# EAGLE design current_mirror (EAGLE 9.5.0)

## Sheet 1 of 2
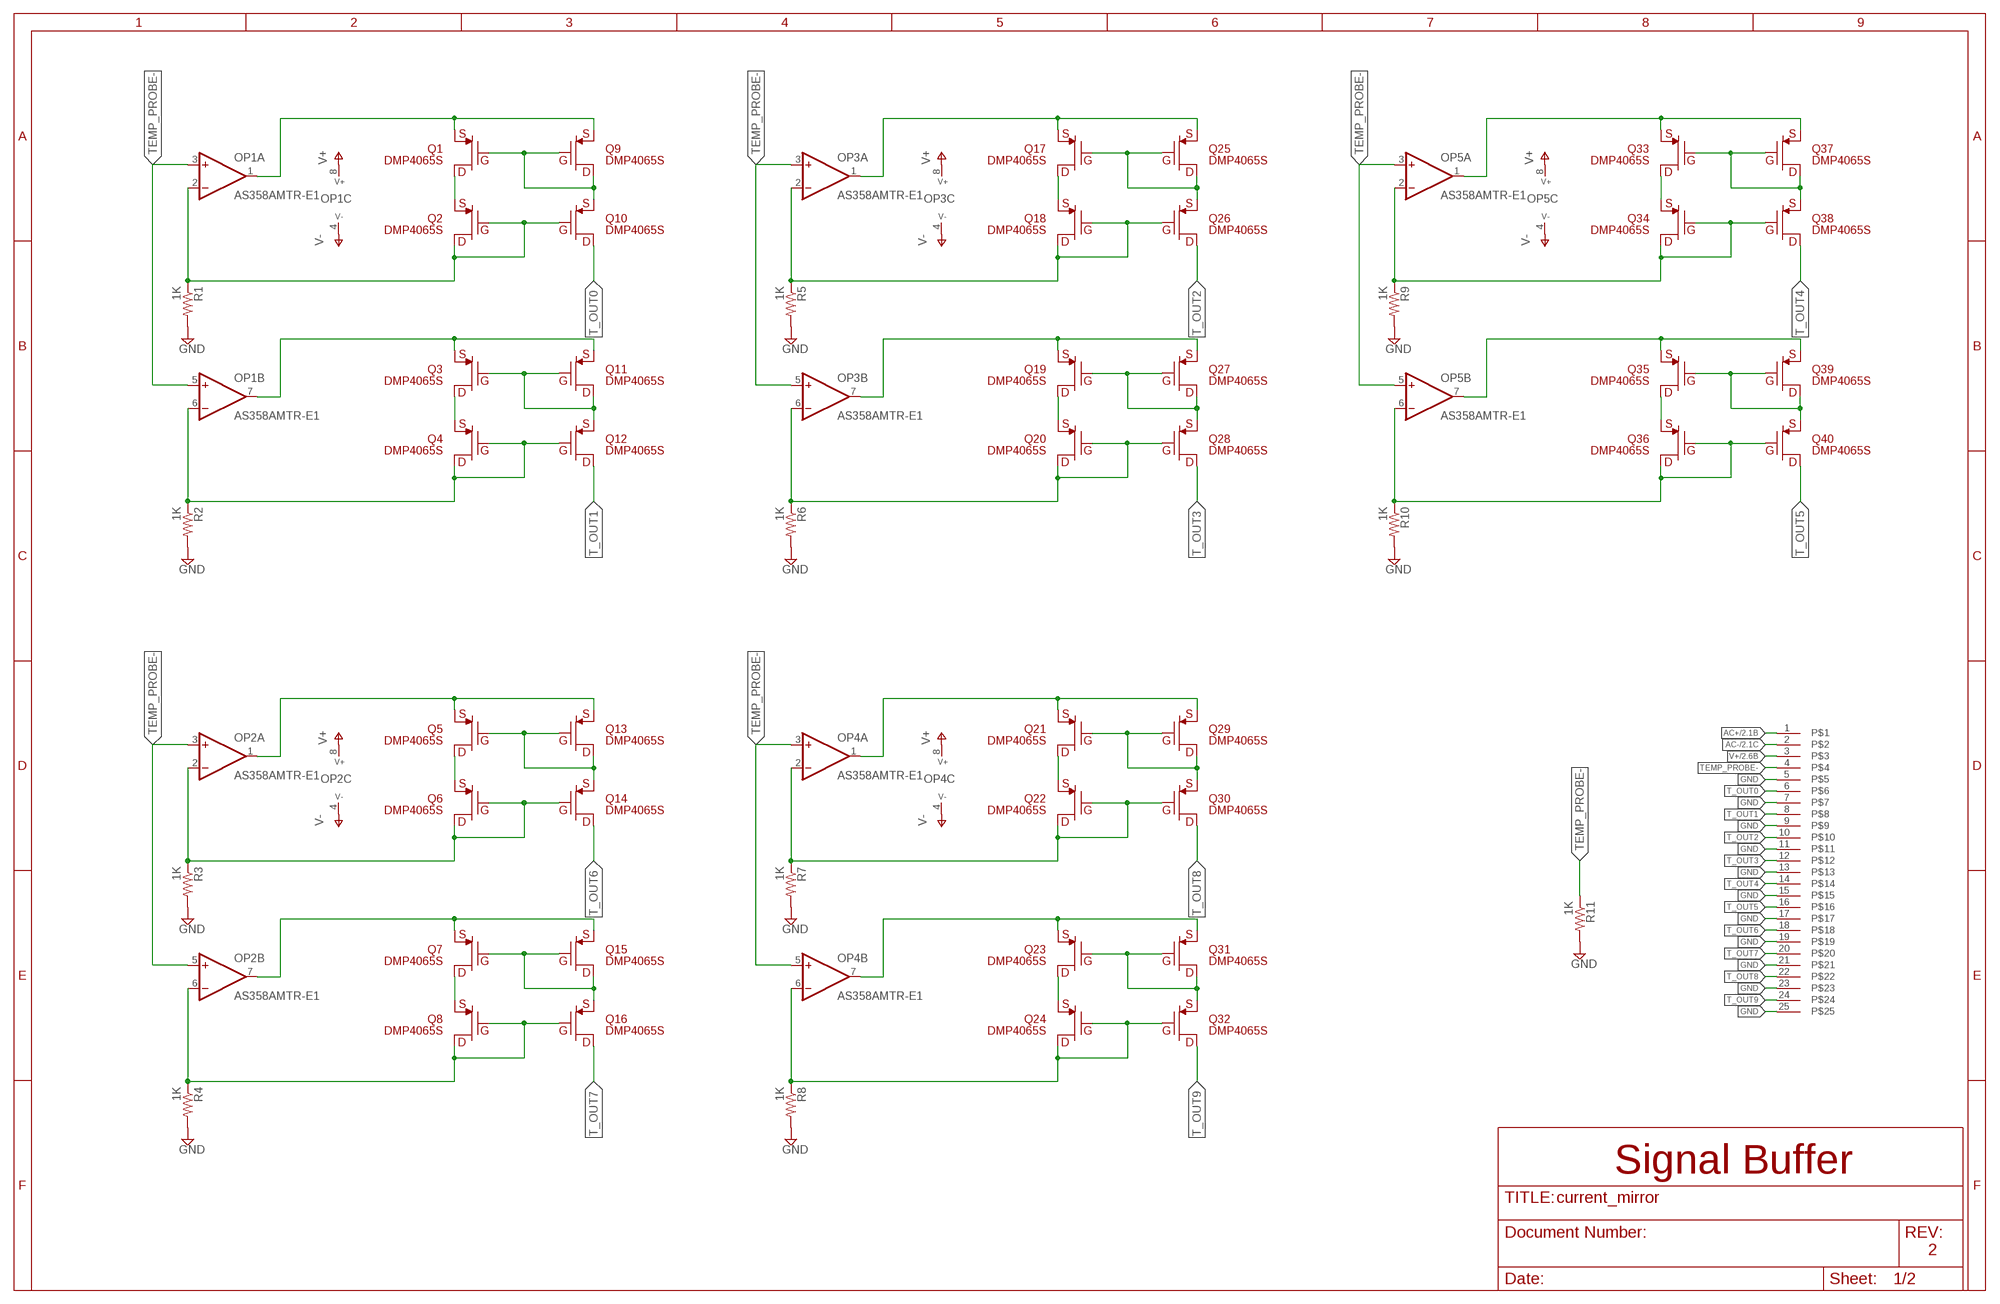
[diagram p0: schematic, sheet 1]

### Parts
J1  2-282836-6  [SCREW_TERMINAL_25]
OP1  AS358AMTR-E1  [SOIC-8]
OP2  AS358AMTR-E1  [SOIC-8]
OP3  AS358AMTR-E1  [SOIC-8]
OP4  AS358AMTR-E1  [SOIC-8]
OP5  AS358AMTR-E1  [SOIC-8]
Q1  DMP4065S  [SOT23]
Q2  DMP4065S  [SOT23]
Q3  DMP4065S  [SOT23]
Q4  DMP4065S  [SOT23]
Q5  DMP4065S  [SOT23]
Q6  DMP4065S  [SOT23]
Q7  DMP4065S  [SOT23]
Q8  DMP4065S  [SOT23]
Q9  DMP4065S  [SOT23]
Q10  DMP4065S  [SOT23]
Q11  DMP4065S  [SOT23]
Q12  DMP4065S  [SOT23]
Q13  DMP4065S  [SOT23]
Q14  DMP4065S  [SOT23]
Q15  DMP4065S  [SOT23]
Q16  DMP4065S  [SOT23]
Q17  DMP4065S  [SOT23]
Q18  DMP4065S  [SOT23]
Q19  DMP4065S  [SOT23]
Q20  DMP4065S  [SOT23]
Q21  DMP4065S  [SOT23]
Q22  DMP4065S  [SOT23]
Q23  DMP4065S  [SOT23]
Q24  DMP4065S  [SOT23]
Q25  DMP4065S  [SOT23]
Q26  DMP4065S  [SOT23]
Q27  DMP4065S  [SOT23]
Q28  DMP4065S  [SOT23]
Q29  DMP4065S  [SOT23]
Q30  DMP4065S  [SOT23]
Q31  DMP4065S  [SOT23]
Q32  DMP4065S  [SOT23]
Q33  DMP4065S  [SOT23]
Q34  DMP4065S  [SOT23]
Q35  DMP4065S  [SOT23]
Q36  DMP4065S  [SOT23]
Q37  DMP4065S  [SOT23]
Q38  DMP4065S  [SOT23]
Q39  DMP4065S  [SOT23]
Q40  DMP4065S  [SOT23]
R1  1K  R-US_R1206  [R1206]
R2  1K  R-US_R1206  [R1206]
R3  1K  R-US_R1206  [R1206]
R4  1K  R-US_R1206  [R1206]
R5  1K  R-US_R1206  [R1206]
R6  1K  R-US_R1206  [R1206]
R7  1K  R-US_R1206  [R1206]
R8  1K  R-US_R1206  [R1206]
R9  1K  R-US_R1206  [R1206]
R10  1K  R-US_R1206  [R1206]
R11  1K  R-US_R1206  [R1206]

### Nets
AC+ [POWER]: J1.1 ; also sheet 2
AC- [POWER]: J1.2 ; also sheet 2
GND [GND]: J1.5 J1.7 J1.9 J1.11 J1.13 J1.15 J1.17 J1.19 J1.21 J1.23 J1.25 R1.2 R2.2 R3.2 R4.2 R5.2 R6.2 R7.2 R8.2 R9.2 R10.2 R11.2 ; also sheet 2
N$1: OP1.1(A:OUT) Q1.2(S1) Q9.2(S1)
N$2: Q1.1(G1) Q9.1(G1) Q9.3(D1) Q10.2(S1)
N$3: Q1.3(D1) Q2.2(S1)
N$4: OP1.7(B:OUT) Q3.2(S1) Q11.2(S1)
N$6: OP1.2(A:-IN) Q2.1(G1) Q2.3(D1) Q10.1(G1) R1.1
N$7: Q3.1(G1) Q11.1(G1) Q11.3(D1) Q12.2(S1)
N$8: Q3.3(D1) Q4.2(S1)
N$10: OP1.6(B:-IN) Q4.1(G1) Q4.3(D1) Q12.1(G1) R2.1
N$13: OP3.1(A:OUT) Q17.2(S1) Q25.2(S1)
N$14: Q17.1(G1) Q25.1(G1) Q25.3(D1) Q26.2(S1)
N$15: Q17.3(D1) Q18.2(S1)
N$16: OP3.2(A:-IN) Q18.1(G1) Q18.3(D1) Q26.1(G1) R5.1
N$17: OP3.7(B:OUT) Q19.2(S1) Q27.2(S1)
N$18: Q19.1(G1) Q27.1(G1) Q27.3(D1) Q28.2(S1)
N$19: Q19.3(D1) Q20.2(S1)
N$20: OP3.6(B:-IN) Q20.1(G1) Q20.3(D1) Q28.1(G1) R6.1
N$21: OP5.1(A:OUT) Q33.2(S1) Q37.2(S1)
N$22: Q33.1(G1) Q37.1(G1) Q37.3(D1) Q38.2(S1)
N$23: Q33.3(D1) Q34.2(S1)
N$24: OP5.2(A:-IN) Q34.1(G1) Q34.3(D1) Q38.1(G1) R9.1
N$25: OP5.7(B:OUT) Q35.2(S1) Q39.2(S1)
N$26: Q35.1(G1) Q39.1(G1) Q39.3(D1) Q40.2(S1)
N$27: Q35.3(D1) Q36.2(S1)
N$28: OP5.6(B:-IN) Q36.1(G1) Q36.3(D1) Q40.1(G1) R10.1
N$29: OP2.1(A:OUT) Q5.2(S1) Q13.2(S1)
N$30: Q5.1(G1) Q13.1(G1) Q13.3(D1) Q14.2(S1)
N$31: Q5.3(D1) Q6.2(S1)
N$32: OP2.2(A:-IN) Q6.1(G1) Q6.3(D1) Q14.1(G1) R3.1
N$33: OP2.7(B:OUT) Q7.2(S1) Q15.2(S1)
N$34: Q7.1(G1) Q15.1(G1) Q15.3(D1) Q16.2(S1)
N$35: Q7.3(D1) Q8.2(S1)
N$36: OP2.6(B:-IN) Q8.1(G1) Q8.3(D1) Q16.1(G1) R4.1
N$37: OP4.1(A:OUT) Q21.2(S1) Q29.2(S1)
N$38: Q21.1(G1) Q29.1(G1) Q29.3(D1) Q30.2(S1)
N$39: Q21.3(D1) Q22.2(S1)
N$40: OP4.2(A:-IN) Q22.1(G1) Q22.3(D1) Q30.1(G1) R7.1
N$41: OP4.7(B:OUT) Q23.2(S1) Q31.2(S1)
N$42: Q23.1(G1) Q31.1(G1) Q31.3(D1) Q32.2(S1)
N$43: Q23.3(D1) Q24.2(S1)
N$44: OP4.6(B:-IN) Q24.1(G1) Q24.3(D1) Q32.1(G1) R8.1
T_OUT0: J1.6 Q10.3(D1)
T_OUT1: J1.8 Q12.3(D1)
T_OUT2: J1.10 Q26.3(D1)
T_OUT3: J1.12 Q28.3(D1)
T_OUT4: J1.14 Q38.3(D1)
T_OUT5: J1.16 Q40.3(D1)
T_OUT6: J1.18 Q14.3(D1)
T_OUT7: J1.20 Q16.3(D1)
T_OUT8: J1.22 Q30.3(D1)
T_OUT9: J1.24 Q32.3(D1)
TEMP_PROBE-: J1.4 OP1.3(A:+IN) OP1.5(B:+IN) OP2.3(A:+IN) OP2.5(B:+IN) OP3.3(A:+IN) OP3.5(B:+IN) OP4.3(A:+IN) OP4.5(B:+IN) OP5.3(A:+IN) OP5.5(B:+IN) R11.1
V+ [POWER]: J1.3 OP1.8(C:V+) OP2.8(C:V+) OP3.8(C:V+) OP4.8(C:V+) OP5.8(C:V+) ; also sheet 2
V- [POWER]: OP1.4(C:V-) OP2.4(C:V-) OP3.4(C:V-) OP4.4(C:V-) OP5.4(C:V-) ; also sheet 2

### Notes on the sheet
- Signal Buffer
- 2

## Sheet 2 of 2
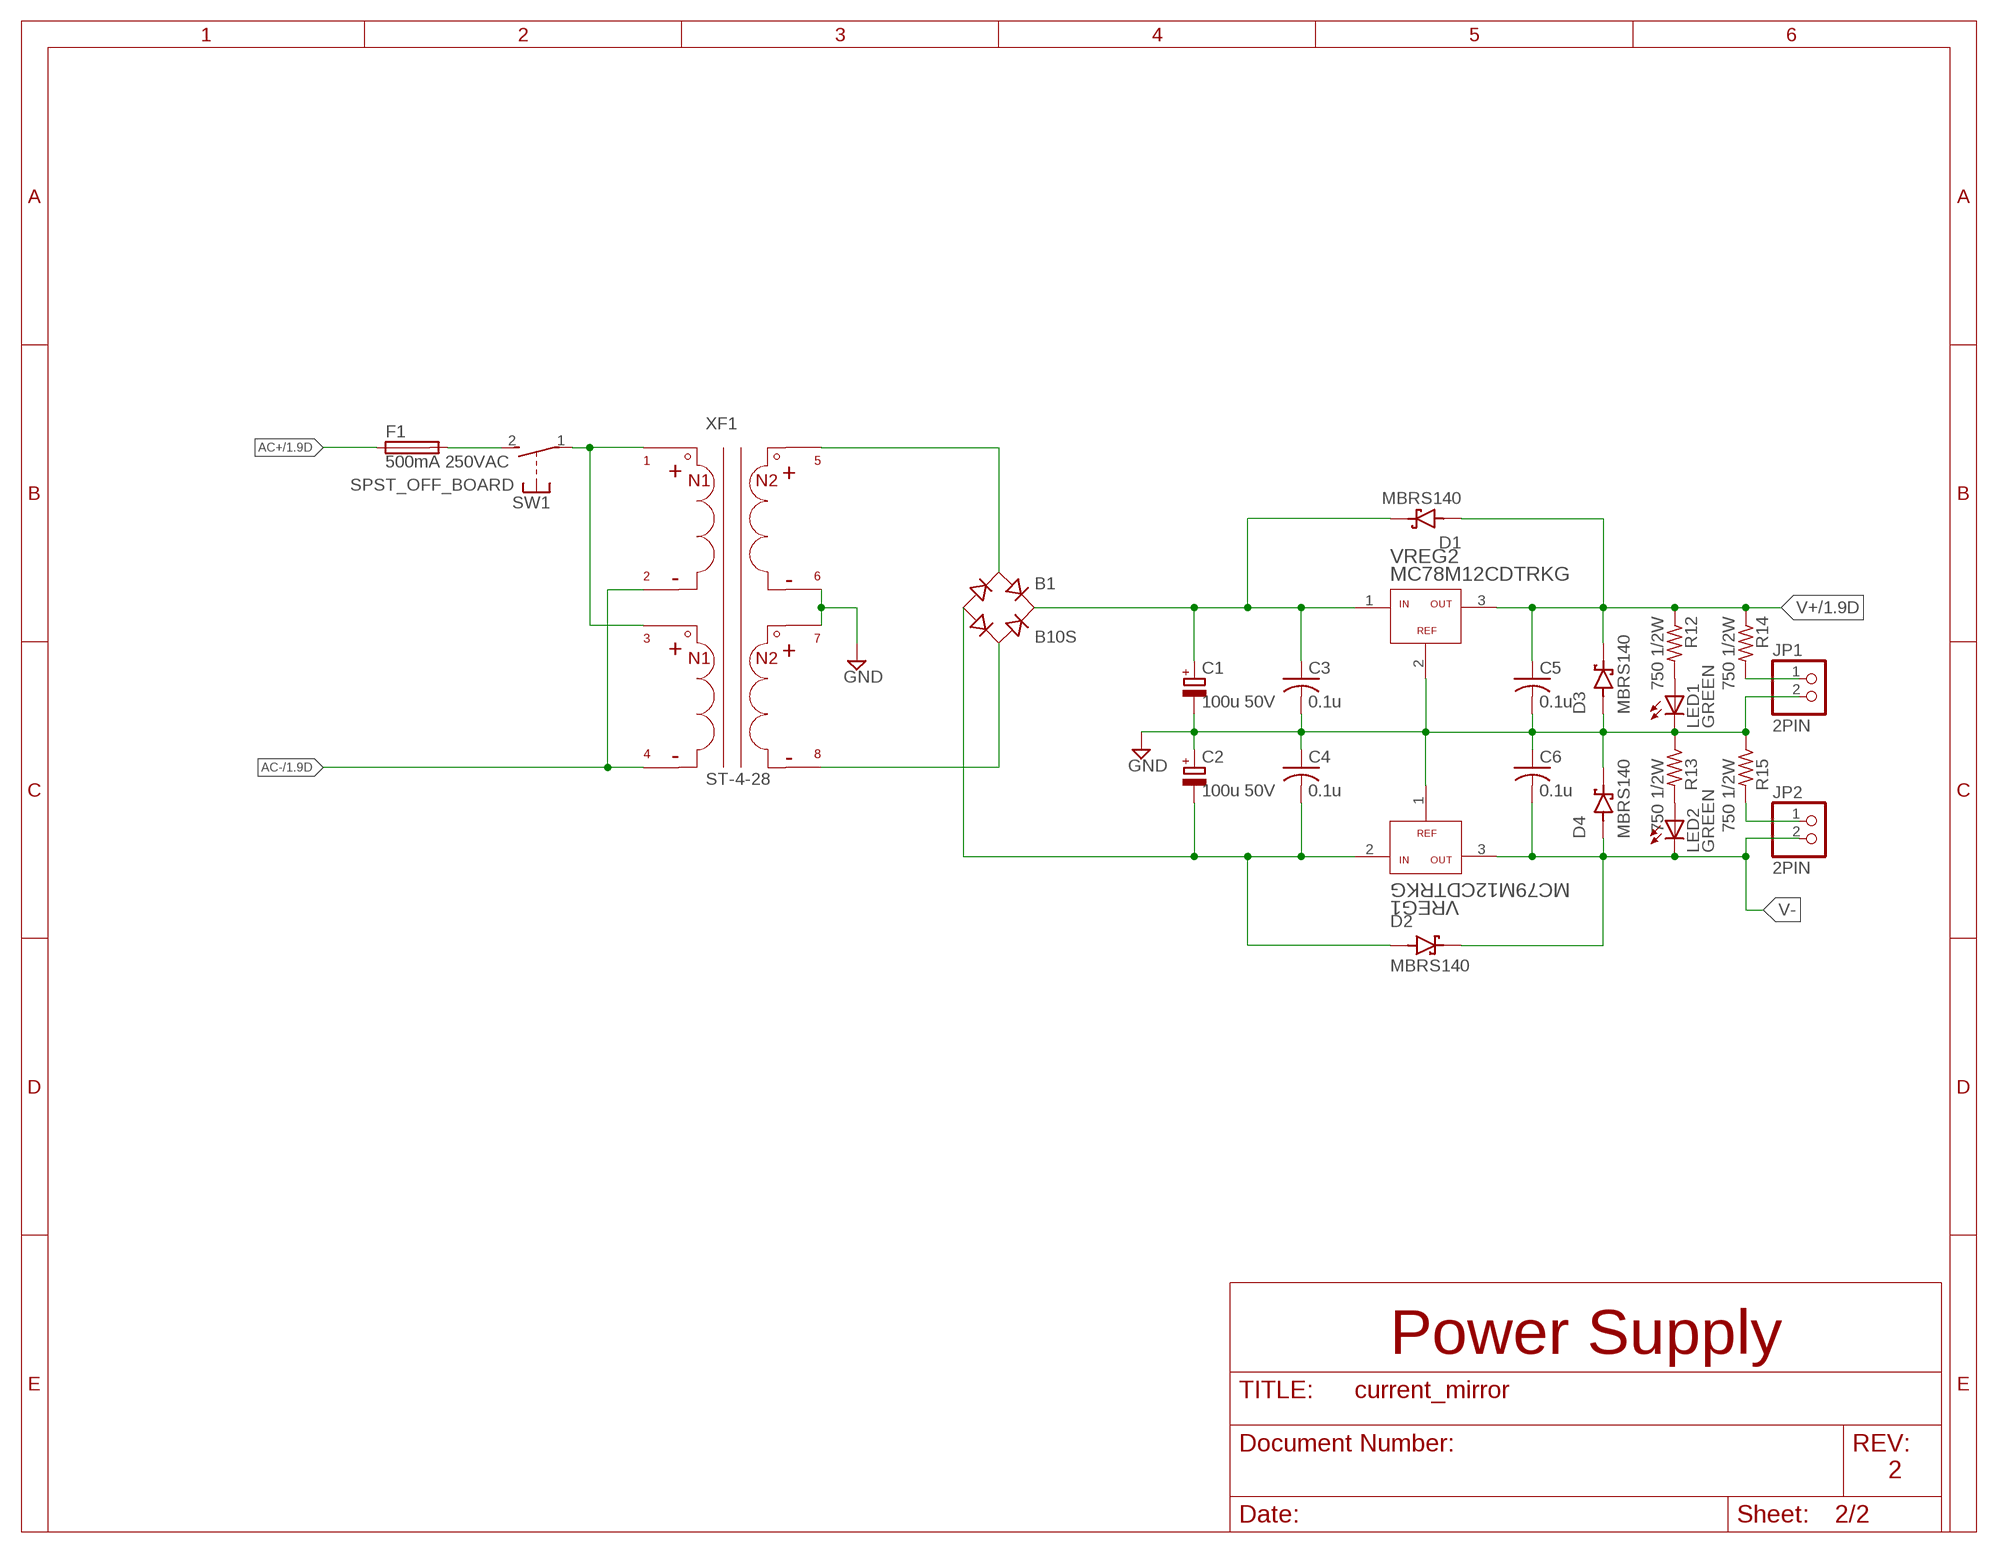
[diagram p1: schematic, sheet 2]

### Parts
B1  B10S  [MBS]
C1  100u 50V  CPOL-EU153CLV-1010  [153CLV-1010]
C2  100u 50V  CPOL-EU153CLV-1010  [153CLV-1010]
C3  0.1u  C-USC0603  [C0603]
C4  0.1u  C-USC0603  [C0603]
C5  0.1u  C-USC0603  [C0603]
C6  0.1u  C-USC0603  [C0603]
D1  MBRS140  [DIO_MBRS140]
D2  MBRS140  [DIO_MBRS140]
D3  MBRS140  [DIO_MBRS140]
D4  MBRS140  [DIO_MBRS140]
F1  500mA 250VAC  SH22  [SH22]
JP1  2PIN  PINHD-1X2  [1X02]
JP2  2PIN  PINHD-1X2  [1X02]
LED1  GREEN  LEDCHIP-LED0603  [CHIP-LED0603]
LED2  GREEN  LEDCHIP-LED0603  [CHIP-LED0603]
R12  750 1/2W  R-US_R1206  [R1206]
R13  750 1/2W  R-US_R1206  [R1206]
R14  750 1/2W  R-US_R1206  [R1206]
R15  750 1/2W  R-US_R1206  [R1206]
SW1  SPST_OFF_BOARD  [SPST_OFF_BOARD]
VREG1  MC79M12CDTRKG  [DPAK-3]
VREG2  MC78M12CDTRKG  [DPAK-3]
XF1  ST-4-28  [ST-4-28]

### Nets
AC+ [POWER]: F1.1 ; also sheet 1
AC- [POWER]: XF1.P$2 XF1.P$4 ; also sheet 1
GND [GND]: C1.- C2.+ C3.2 C4.1 C5.2 C6.1 D3.A D4.C(K) JP1.2 LED1.C R13.1 R15.1 VREG1.1(GND) VREG2.2(GND) XF1.P$6 XF1.P$7 ; also sheet 1
N$5 [POWER]: B1.AC1 XF1.P$5
N$9 [POWER]: B1.AC2 XF1.P$8
N$11 [POWER]: SW1.1(P) XF1.P$1 XF1.P$3
N$12 [POWER]: F1.2 SW1.2(S)
N$45: LED1.A R12.2
N$46: LED2.A R13.2
N$47: JP2.1 R15.2
N$48: JP1.1 R14.2
R+ [POWER]: B1.+ C1.+ C3.1 D1.C(K) VREG2.1(VIN)
R- [POWER]: B1.- C2.- C4.2 D2.A VREG1.2(VIN)
V+ [POWER]: C5.1 D1.A D3.C(K) R12.1 R14.1 VREG2.3(VOUT) ; also sheet 1
V- [POWER]: C6.2 D2.C(K) D4.A JP2.2 LED2.C VREG1.3(VOUT) ; also sheet 1

### Notes on the sheet
- Power Supply
- 2

## Library data of the parts
B1 = rectifier:B*S: Surface Mount Glass Passivated Bridge Rectifiers Source: Comchip Bridge Rectifiers B05S-G_B10S-G.pdf
C1 C2 = rcl:CPOL-EU: POLARIZED CAPACITOR, European symbol; SPICEPREFIX: C
C3-C6 = adafruit:C-US: CAPACITOR, American symbol
D1-D4 = MBRS140:MBRS140: MBRS140 Series 1 A 40 V SMD Schottky Barrier Rectifier - DO-214AA; DESCRIPTION: Diode Schottky 40V 1A Surface Mount SMB _DO-214AA_; DIGI-KEY_PART_NUMBER: MBRS140FSCT-ND; DIGI-KEY_PURCHASE_URL: https://www.digikey.com/product-detail/en/on-semiconductor/MBRS140/MBRS140FSCT-ND/2094422?utm_source=snapeda&utm_medium=aggregator&utm_campaign=symbol; JLCPCB_PART_NUMBER: C133091; MF: ON Semiconductor; MP: MBRS140; PACKAGE: DO-214 ON Semiconductor
F1 = fuse:SH22: FUSE HOLDER CS PFP30, Schukat; OC_FARNELL: unknown; OC_NEWARK: unknown
J1 = CONNECTOR:2-282836-6
JP1 JP2 = pinhead:PINHD-1X2: PIN HEADER
LED1 LED2 = adafruit:LED: LED OSRAM: - CHIPLED LG R971, LG N971, LY N971, LG Q971, LY Q971, LO R971, LY R971 LH N974, LH R974 LS Q976, LO Q976, LY Q976 LO Q996 - Hyper CHIPLED LW Q18S LB Q993, LB Q99A, LB R99A - SideLED LS A670, LO A670, LY A670, LG A670, LP A670 LB A673, LV A673, LT A673, LW A673 LH A674 LY A675 LS A676, LA A676, LO A676, LY A676, LW A676 LS A679, LY A679, LG A679 - Hyper Micro SIDELED® LS Y876, LA Y876, LO Y876, LY Y876 LT Y87S - SmartLED LW L88C, LW L88S LB L89C, LB L89S, LG L890 LS L89K, LO L89K, LY L89K LS L896, LA L896, LO L896, LY L896 - TOPLED LS T670, LO T670, LY T670, LG T670, LP T670 LSG T670, LSP T670, LSY T670, LOP T670, LYG T670 LG T671, LOG T671, LSG T671 LB T673, LV T673, LT T673, LW T673 LH T674 LS T676, LA T676, LO T676, LY T676, LB T676, LH T676, LSB T676, LW T676 LB T67C, LV T67C, LT T67C, LS T67K, LO T67K, LY T67K, LW E67C LS E67B, LA E67B, LO E67B, LY E67B, LB E67C, LV E67C, LT E67C LW T67C LS T679, LY T679, LG T679 LS T770, LO T770, LY T770, LG T770, LP T770 LB T773, LV T773, LT T773, LW T773 LH T774 LS E675, LA E675, LY E675, LS T675 LS T776, LA T776, LO T776, LY T776, LB T776 LHGB T686 LT T68C, LB T68C - Hyper Mini TOPLED® LB M676 - Mini TOPLED Santana® LG M470 LS M47K, LO M47K, LY M47K Source: http://www.osram.convergy.de/
OP1-OP5 = DUAL_MOSFET-BSS84DW-7-F :AS358AMTR-E1; JLCPCB_PART_NUMBER: C141322
Q1-Q40 = DUAL_MOSFET-BSS84DW-7-F :DMP4065S; JLCPCB_PART_NUMBER: C182476
R1-R15 = rcl:R-US_: RESISTOR, American symbol; SPICEPREFIX: R
SW1 = CONNECTOR:SPST_OFF_BOARD
VREG1 = VOLTAGE_REGULATOR:MC79M12CDTRKG; JLCPCB_PART_NUMBER: C67852
VREG2 = VOLTAGE_REGULATOR:MC78M12CDTRKG; COPYRIGHT: Copyright (C) 2016 Accelerated Designs. All rights reserved; JLCPCB_PART_NUMBER: C67851; MANUFACTURER_PART_NUMBER: MC78M12CDTRKG; VENDOR: ON Semiconductor
XF1 = TRANSFORMER:ST-4-28

## Net classes
1 POWER: width 0.381 mm, drill 0.127 mm, clearance 0.127 mm
2 GND: width 0.381 mm, drill 0.127 mm, clearance 0.127 mm

## Board
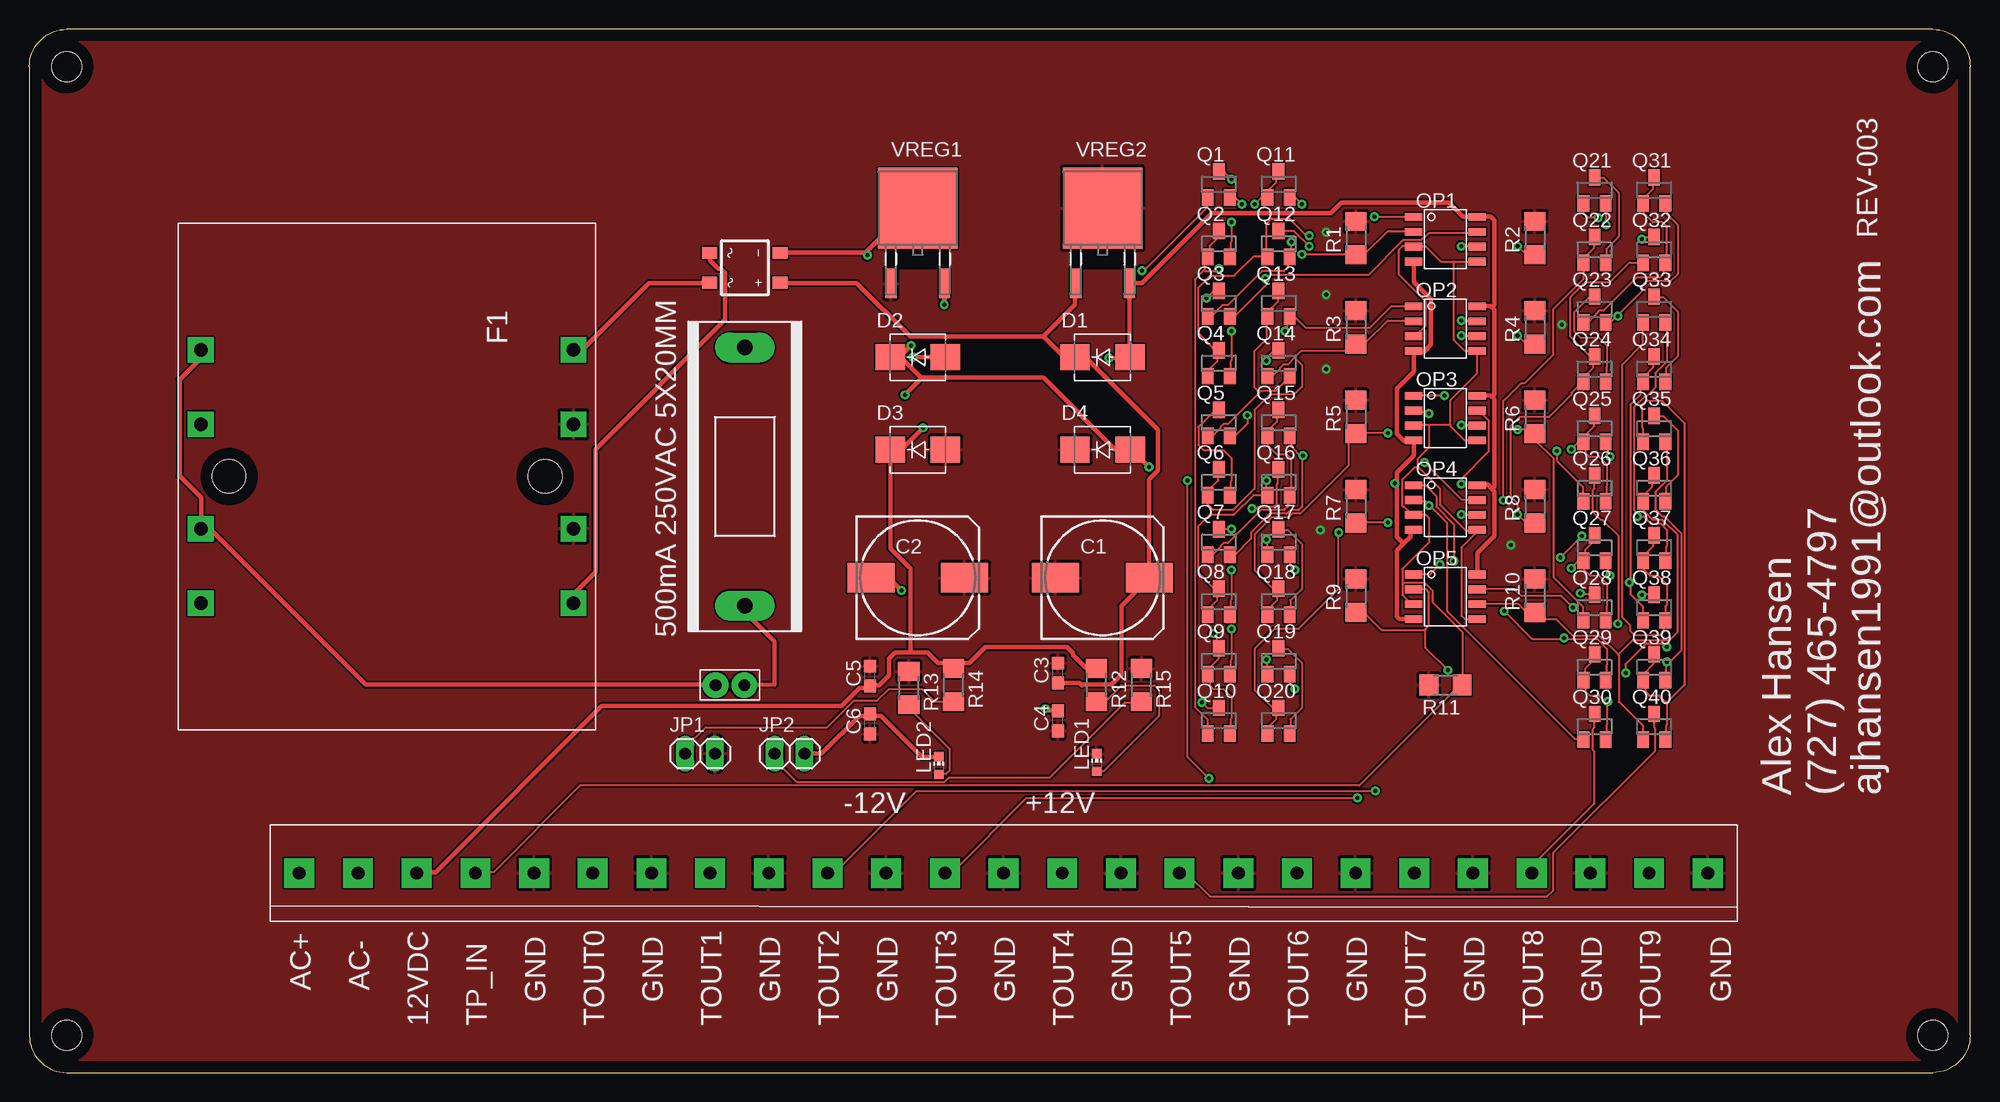
[diagram p2: board, top side]
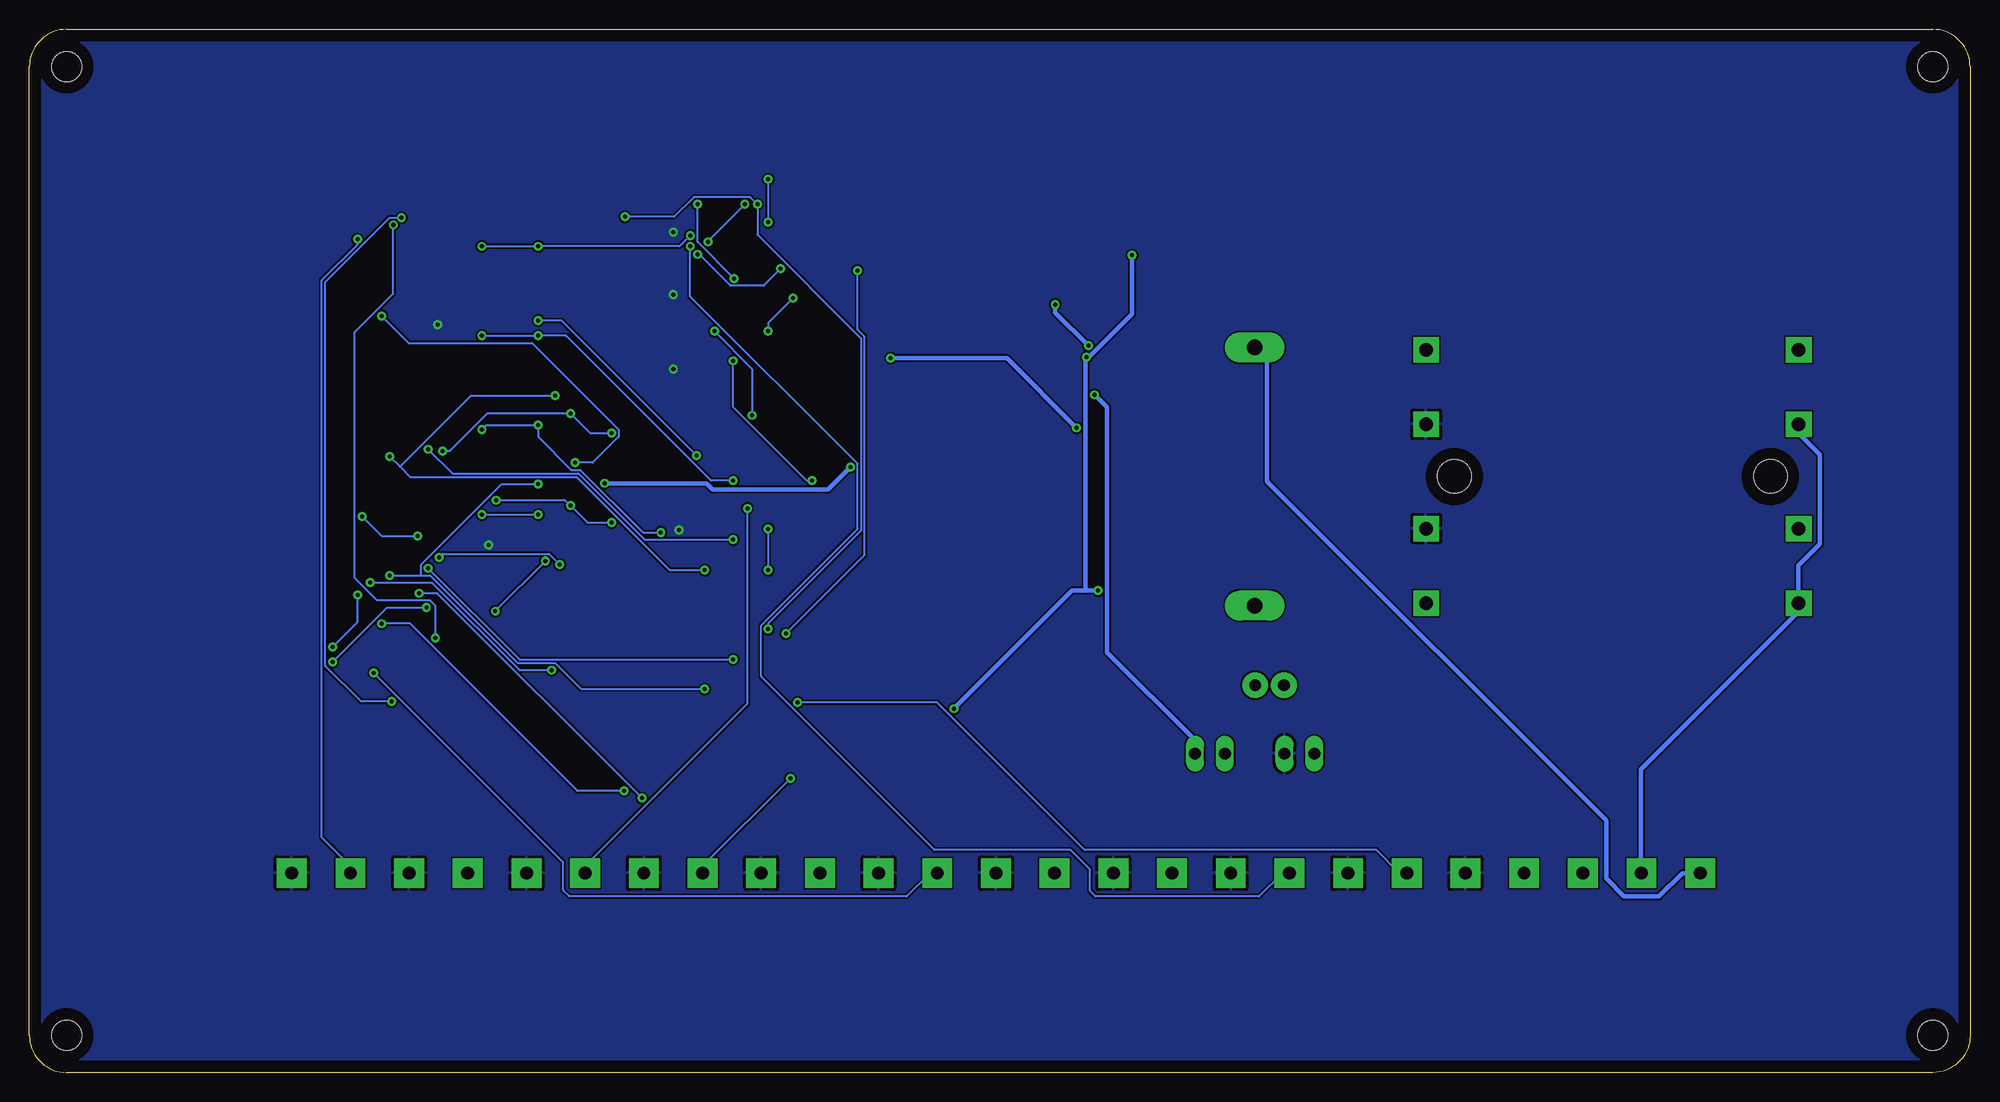
[diagram p3: board, bottom side, seen from below]

Size 165.35 x 88.9 mm. Coordinates in mm from the lower left corner, seen from the top.
Outline: 0,85.72 0,3.17 arc90 3.17,0 162.18,0 arc90 165.35,3.17 165.35,85.72 arc90 162.18,88.9 3.17,88.9 arc90 0,85.72
Copper layers (1*16): Top 0.035mm / dielectric 1.5mm / Bottom 0.035mm
Design rules "default": minimum track width 6mil, minimum drill 0.35mm, track to track 6mil, track to pad 6mil, pad to pad 6mil, via to via 6mil, smd to smd 6mil, copper to edge 40mil, drill to drill 6mil, minimum pad ring 10mil, minimum via ring 8mil, stop-mask expansion 4mil, vias tented up to drill 0mil, thermal gap 10mil
Holes 2.54 mm at 3.17,85.72 3.17,3.17 162.18,3.17 162.18,85.72

### Footprints (pad centres in the part's own frame; a part is rotated, then mirrored left to right if it is on the bottom)
MBS = smd 1 x 1.3: + -1.27,-3; - 1.27,-3; AC1 -1.27,3; AC2 1.27,3
153CLV-1010 = smd 4 x 2.5: + 4,0; - -4,0
C0603 = smd 1.1 x 1: 1 -0.85,0; 2 0.85,0
DIO_MBRS140 = smd 2.5 x 2.2: A 2.35,0; C -2.35,0
SH22 = drill 1.321 pad 2.54 long: 1 -10.998,0; 2 10.998,0
SCREW_TERMINAL_25 = drill 1.1 pad 2.54 square: 1 -60,0; 2 -55,0; 3 -50,0; 4 -45,0; 5 -40,0; 6 -35,0; 7 -30,0; 8 -25,0; 9 -20,0; 10 -15,0; 11 -10,0; 12 -5,0; 13 0,0; 14 5,0; 15 10,0; 16 15,0; 17 20,0; 18 25,0; 19 30,0; 20 35,0; 21 40,0; 22 45,0; 23 50,0; 24 55,0; 25 60,0
1X02 = drill 1.016 long: 1 -1.27,0; 2 1.27,0
CHIP-LED0603 = smd 0.8 x 0.8: A 0,-0.75; C 0,0.75
SOIC-8 = smd 1.5 x 0.65: 1 -2.7,1.8; 2 -2.7,0.53; 3 -2.7,-0.74; 4 -2.7,-2.01; 5 2.7,-2.01; 6 2.7,-0.74; 7 2.7,0.53; 8 2.7,1.8
SOT23 = smd 1 x 1.4: 1 -0.95,-1.1; 2 0.95,-1.1; 3 0,1.1
R1206 = smd 1.6 x 1.803: 1 -1.422,0; 2 1.422,0
SPST_OFF_BOARD = drill 1 pad 2.184: 1 -2.5,0; 2 -0.04,0
DPAK-3 = smd 0.94 x 2.489: 1 -2.29,-6.413; 3 2.29,-6.413 | smd 6.782 x 6.934: 2 0,0
ST-4-28 = drill 1.143 pad 2.184 square: P$1 15.875,-10.795; P$2 15.875,-4.445; P$3 15.875,4.445; P$4 15.875,10.795; P$5 -15.875,-10.795; P$6 -15.875,-4.445; P$7 -15.875,4.445; P$8 -15.875,10.795 | hole 2.845: 13.462,0; -13.462,0

### Placement (x,y rotation side)
B1  60.96,68.58 90 top
C1  91.44,42.16 0 top
C2  75.69,42.16 0 top
C3  87.63,34.04 90 top
C4  87.63,29.97 90 top
C5  71.63,33.78 90 top
C6  71.63,29.72 90 top
D1  91.44,60.96 0 top
D2  75.69,60.96 0 top
D3  75.69,53.09 0 top
D4  91.44,53.09 0 top
F1  60.96,50.8 270 top
J1  83,17 0 top
JP1  57.15,27.18 0 top
JP2  64.77,27.18 0 top
LED1  90.93,26.42 0 top
LED2  77.47,26.16 0 top
OP1  120.65,71.12 0 top
OP2  120.65,63.5 0 top
OP3  120.65,55.88 0 top
OP4  120.65,48.26 0 top
OP5  120.65,40.64 0 top
Q1  101.35,75.69 0 top
Q2  101.35,70.61 0 top
Q3  101.35,65.53 0 top
Q4  101.35,60.45 0 top
Q5  101.35,55.37 0 top
Q6  101.35,50.29 0 top
Q7  101.35,45.21 0 top
Q8  101.35,40.13 0 top
Q9  101.35,35.05 0 top
Q10  101.35,29.97 0 top
Q11  106.43,75.69 0 top
Q12  106.43,70.61 0 top
Q13  106.43,65.53 0 top
Q14  106.43,60.45 0 top
Q15  106.43,55.37 0 top
Q16  106.43,50.29 0 top
Q17  106.43,45.21 0 top
Q18  106.43,40.13 0 top
Q19  106.43,35.05 0 top
Q20  106.43,29.97 0 top
Q21  133.35,75.18 0 top
Q22  133.35,70.1 0 top
Q23  133.35,65.02 0 top
Q24  133.35,59.94 0 top
Q25  133.35,54.86 0 top
Q26  133.35,49.78 0 top
Q27  133.35,44.7 0 top
Q28  133.35,39.62 0 top
Q29  133.35,34.54 0 top
Q30  133.35,29.46 0 top
Q31  138.43,75.18 0 top
Q32  138.43,70.1 0 top
Q33  138.43,65.02 0 top
Q34  138.43,59.94 0 top
Q35  138.43,54.86 0 top
Q36  138.43,49.78 0 top
Q37  138.43,44.7 0 top
Q38  138.43,39.62 0 top
Q39  138.43,34.54 0 top
Q40  138.43,29.46 0 top
R1  113.03,71.12 90 top
R2  128.27,71.12 90 top
R3  113.03,63.5 90 top
R4  128.27,63.5 90 top
R5  113.03,55.88 90 top
R6  128.27,55.88 90 top
R7  113.03,48.26 90 top
R8  128.27,48.26 90 top
R9  113.03,40.64 90 top
R10  128.27,40.64 90 top
R11  120.65,33.02 180 top
R12  90.93,33.02 270 top
R13  74.93,32.77 270 top
R14  78.74,33.02 270 top
R15  94.74,33.02 270 top
SW1  60.96,33.02 0 top
VREG1  75.69,73.66 0 top
VREG2  91.44,73.66 0 top
XF1  30.48,50.8 180 top

### Tracks (layer width: path | path; a pad name or v marks a point on that pad's centre or on a via)
AC+
  Bottom 0.381: F1.1 59.89,60.73 59.89,50.37 31.01,21.49 31.01,16.54 29.49,15.01 26.52,15.01 24.54,16.99 23.01,16.99 J1.1
AC-
  Bottom 0.381: XF1.P$2 14.55,55.24 14.55,54.41 12.8,52.65 12.8,45.03 14.63,43.2 14.63,40.01 XF1.P$4 14.71,39.85 14.71,39.17 28.04,25.83 28.04,17.07 J1.2
GND  (via drill 0.35)
  other vias: 110.49,66.29 110.49,71.63 110.49,59.94 109.98,46.23 126.24,44.96 130.56,63.75
  pour Bottom: 0,88.9 165.35,88.9 165.35,0 0,0
  pour Top: 165.35,88.9 0,88.9 0,0 165.35,0
N$1  (via drill 0.35)
  Top 0.152: v102.41,37.8 102.41,35.2 102.34,35.13 102.34,33.98 Q9.2 | v103.33,73.99 102.79,74.52 102.34,74.52 Q1.2 | v114.61,72.92 117.88,72.92 OP1.1
  Bottom 0.152: v102.41,37.8 102.41,38.25 94.49,46.18 94.49,62.56 103.33,71.4 v103.33,73.99 103.94,74.6 108.74,74.6 110.41,72.92 v114.61,72.92
N$2  (via drill 0.35)
  Top 0.152: Q10.2 102.34,28.88 102.34,30.1 102.41,30.18 102.41,32 101.73,32.69 100.89,32.69 100.58,32.99 100.58,33.76 100.43,33.91 Q9.1 100.43,33.98 100.43,34.37 101.35,35.28 Q9.3 101.35,36.2 101.19,36.35 101.19,37.11 v100.89,37.41 | v94.79,68.35 94.94,68.35 100.36,73.76 100.36,74.52 Q1.1
  Bottom 0.152: v94.79,68.35 94.79,63.32 94.18,62.71 94.18,44.12 v100.89,37.41
N$3  (via drill 0.35)
  Top 0.152: v102.41,72.47 102.41,70.79 102.34,70.71 102.34,69.57 Q2.2 | v102.41,76.12 101.8,76.73 101.35,76.73 Q1.3
  Bottom 0.152: v102.41,76.12 v102.41,72.47
N$4  (via drill 0.35)
  Top 0.152: 105.42,67.63 105.77,67.97 114.07,67.97 117.04,70.94 118.57,70.94 118.72,71.09 118.8,71.09 119.25,71.55 123.22,71.55 123.29,71.63 OP1.7 | 105.42,67.63 105.39,67.59 105.39,67.13 102.72,64.47 102.34,64.47 Q3.2 | v108.43,73.99 107.9,74.52 107.44,74.52 Q11.2 | v105.31,67.67 105.39,67.67 105.42,67.63
  Bottom 0.152: v108.43,73.99 108.43,70.79 v105.31,67.67
N$5
  Top 0.381: B1.AC1 57.91,67.28 52.81,67.28 47.17,61.65 46.41,61.65 XF1.P$5
N$6  (via drill 0.35)
  Top 0.152: OP1.2 117.88,71.7 115.75,71.7 113.77,69.72 113.08,69.72 R1.1 113,69.72 v108.43,69.72 | 100.09,68.39 100.13,68.43 100.13,69.27 100.36,69.49 Q2.1 100.43,69.57 100.58,69.72 100.58,70.48 101.35,71.25 Q2.3 | 100.09,68.39 99.29,67.59 99.29,31.17 100.36,30.1 100.36,28.88 Q10.1 | v101.35,68.5 101.12,68.28 100.2,68.28 100.09,68.39
  Bottom 0.152: v108.43,69.72 108.28,69.72 105.61,67.06 102.79,67.06 v101.35,68.5
N$7  (via drill 0.35)
  Top 0.152: Q11.3 106.38,76.73 106.22,76.58 106.22,75.82 105.54,75.13 105.54,74.6 Q11.1 105.46,74.52 104.93,74.52 v104.39,73.99 | Q3.1 100.43,64.47 100.74,64.47 101.65,65.38 102.11,65.38 105,68.28 106.91,68.28 107.21,68.58 107.21,69.34 107.37,69.49 Q12.2 107.44,69.57 107.52,69.65 v107.52,70.79
  Bottom 0.152: v104.39,73.99 107.52,70.87 v107.52,70.79
N$8  (via drill 0.35)
  Top 0.152: v102.41,63.17 102.41,60.66 102.34,60.58 102.34,59.36 Q4.2 | v100.28,65.99 100.89,66.6 101.35,66.6 Q3.3
  Bottom 0.152: v102.41,63.17 102.41,63.86 v100.28,65.99
N$9
  Top 0.381: B1.AC2 57.99,69.8 57.99,69.19 58.67,68.5 58.9,68.5 59.28,68.12 59.28,64.16 48.23,53.11 48.23,42.67 46.41,40.84 46.41,40.01 XF1.P$8
N$10  (via drill 0.35)
  Top 0.152: v122,70.41 123.29,70.41 OP1.6 | v126.8,70.41 127.48,69.72 128.25,69.72 R2.1 | Q4.1 100.43,59.36 100.43,59.82 101.19,60.58 101.19,61.34 101.35,61.49 Q4.3 101.19,61.42 99.59,63.02 99.59,66.9 100.58,67.89 102.64,67.89 104.32,69.57 105.39,69.57 | 105.39,69.57 105.46,69.57 Q12.1 105.39,69.57 | v109.04,71.32 108.81,71.32 107.37,72.77 105.84,72.77 105.39,72.31 105.39,69.57
  Bottom 0.152: v126.8,70.41 v122,70.41 109.96,70.41 v109.04,71.32
N$11
  Top 0.381: XF1.P$1 14.55,61.57 14.55,60.81 12.8,59.05 12.8,50.83 14.63,49 14.63,46.41 XF1.P$3 14.78,46.33 15.39,46.33 28.65,33.07 58.45,33.07 SW1.1
N$12
  Top 0.381: F1.2 60.96,39.24 63.48,36.73 63.48,33.07 SW1.2
N$13  (via drill 0.35)
  Top 0.152: v107.82,42.82 107.44,43.2 107.44,44.04 Q17.2 | v134.65,52.5 134.49,52.65 134.49,53.57 134.34,53.72 Q25.2 | v120.55,57.68 OP3.1
  Bottom 0.152: v107.82,42.82 110.8,42.82 118.72,50.75 132.89,50.75 133.77,51.63 | v134.65,52.5 133.77,51.63 | v120.55,57.68 127.71,57.68 133.77,51.63
N$14  (via drill 0.35)
  Top 0.152: v105.39,45.41 105.39,45.34 105.46,45.26 105.46,44.12 Q17.1 | v131.37,53.11 131.98,53.72 132.36,53.72 Q25.1 | Q26.2 134.34,48.69 134.34,49.91 134.42,49.99 134.42,51.82 133.73,52.5 132.89,52.5 132.59,52.81 132.59,53.42 132.36,53.65 Q25.1 | Q25.3 133.35,55.09 132.44,54.18 132.44,53.8 Q25.1
  Bottom 0.152: v105.39,45.41 112.93,45.41 118.57,51.05 129.31,51.05 v131.37,53.11
N$15
  Top 0.152: Q18.2 107.44,39.09 107.44,40.23 108.43,41.22 108.43,45.03 107.21,46.25 106.45,46.25 Q17.3
N$16  (via drill 0.35)
  Top 0.152: Q18.1 105.54,39.09 105.54,39.47 106.3,40.23 106.3,41.15 106.38,41.22 Q18.3 106.3,41.22 105.99,41.22 104.39,42.82 104.39,45.87 105.84,47.32 107.29,47.32 107.59,47.62 108.28,47.62 112.39,51.74 112.39,53.8 113,54.41 R5.1 113.08,54.48 v115.75,54.48 | v130.15,52.96 130.15,52.12 132.36,49.91 132.36,48.69 Q26.1 | v119.25,56.16 119.1,56.31 118.03,56.31 117.96,56.39 OP3.2
  Bottom 0.152: v130.15,52.96 129.54,52.96 126.34,56.16 v119.25,56.16 117.58,54.48 v115.75,54.48
N$17  (via drill 0.35)
  Top 0.152: v107.82,32.69 107.44,33.07 107.44,33.91 Q19.2 | v134.65,42.37 134.49,42.52 134.49,43.43 134.34,43.59 Q27.2 | v122,50.14 122,50.6 124.36,52.96 124.36,55.55 123.52,56.39 123.37,56.39 OP3.7
  Bottom 0.152: v107.82,32.69 118.34,32.69 120.55,34.9 123.75,34.9 131.22,42.37 131.98,42.37 | v134.65,42.37 131.98,42.37 | v122,50.14 125.12,50.14 131.98,43.28 131.98,42.37
N$18  (via drill 0.35)
  Top 0.152: v105.39,35.2 105.46,35.13 105.46,33.98 Q19.1 | v131.37,42.98 131.98,43.59 132.36,43.59 Q27.1 | Q28.2 134.34,38.56 134.34,39.7 134.42,39.78 134.42,41.68 133.73,42.37 132.97,42.37 132.36,42.98 132.36,43.51 Q27.1 | Q27.3 133.35,45.34 132.59,44.58 132.59,43.81 132.44,43.66 Q27.1
  Bottom 0.152: v105.39,35.2 123.6,35.2 v131.37,42.98
N$19
  Top 0.152: Q20.2 107.44,28.88 107.44,30.1 108.43,31.09 108.43,34.9 107.21,36.12 106.45,36.12 Q19.3
N$20  (via drill 0.35)
  Top 0.152: Q20.1 105.54,28.88 105.54,29.41 106.22,30.1 106.22,30.86 106.38,31.01 Q20.3 106.22,30.94 106.07,30.94 104.39,32.61 104.39,36.12 106.07,37.8 108.13,37.8 111.48,41.15 111.48,45.95 v111.56,46.02 | Q28.1 132.36,38.56 132.36,39.7 129.84,42.22 129.84,52.35 128.32,53.87 128.32,54.41 R6.1 128.25,54.48 127.94,54.79 v126.8,54.79 | v122,55.17 123.29,55.17 OP3.6
  Bottom 0.152: v126.8,54.79 126.42,55.17 v122,55.17 122,54.18 119.18,51.36 118.42,51.36 113.08,46.02 v111.56,46.02
N$21  (via drill 0.35)
  Top 0.152: 137.12,47.51 136.7,47.93 136.7,56.69 137.62,57.61 137.77,57.61 138.53,58.37 138.53,59.59 139.52,60.58 139.52,63.78 139.45,63.86 Q33.2 | 137.12,47.51 137.24,47.4 137.54,47.4 138.15,46.79 138.99,46.79 139.52,46.25 139.52,44.88 139.45,44.81 139.45,43.66 Q37.2 | v120.17,43.28 119.33,42.44 OP5.1 | v132.28,45.72 v130.45,43.89 | 137.12,47.51 v137.01,47.4
  Bottom 0.152: v120.17,43.28 121.08,44.2 130.15,44.2 v130.45,43.89 | v132.28,45.72 135.33,45.72 v137.01,47.4
N$22
  Top 0.152: Q37.3 138.38,45.8 138.38,44.88 137.54,44.04 137.54,43.66 Q37.1 137.47,43.59 137.47,42.98 138.07,42.37 138.76,42.37 139.52,41.6 139.52,39.85 139.37,39.7 139.37,38.56 Q38.2 139.37,38.48 139.22,38.33 139.22,37.57 138.91,37.26 136.78,37.26 136.4,37.64 136.4,38.1 135.71,38.79 135.71,60.35 137.47,62.1 137.47,63.86 Q33.1
N$23
  Top 0.152: Q34.2 139.45,58.9 139.45,60.05 140.44,61.04 140.44,64.85 139.22,66.06 138.46,66.06 Q33.3
N$24  (via drill 0.35)
  Top 0.152: 118.91,37.76 118.87,37.72 115.21,37.72 113.77,39.17 113.08,39.17 R9.1 | 118.91,37.76 119.25,38.1 119.25,40.92 119.02,41.15 117.96,41.15 OP5.2 | 136.4,41.76 136.4,56.92 137.24,57.76 137.24,58.6 137.47,58.83 Q34.1 137.54,58.9 137.54,59.28 138.38,60.12 138.38,61.04 Q34.3 | 136.4,41.76 136.4,40.77 137.47,39.7 137.47,38.56 Q38.1 | v120.85,34.29 118.95,36.2 118.95,37.72 118.91,37.76 | 136.4,41.76 v136.32,41.76
  Bottom 0.152: v120.85,34.29 123.6,34.29 131.06,41.76 v136.32,41.76
N$25  (via drill 0.35)
  Top 0.152: 139.64,34.86 140.74,35.97 140.74,45.95 139.29,47.4 139.14,47.4 138.53,48.01 138.53,49.45 139.52,50.44 139.52,53.65 139.45,53.72 Q35.2 | 139.64,34.86 139.45,34.67 139.45,33.45 Q39.2 | v131.52,39.62 130.53,40.62 127.1,40.62 126.49,41.22 123.37,41.22 OP5.7 | 139.64,34.86 v139.52,34.98
  Bottom 0.152: v131.52,39.62 134.87,39.62 v139.52,34.98
N$26
  Top 0.152: 139.48,31.51 138.84,32.16 138,32.16 137.69,32.46 137.69,33.22 137.54,33.38 Q39.1 137.54,33.45 137.54,33.98 138.38,34.82 138.38,35.59 Q39.3 | 139.48,31.51 139.52,31.47 139.52,29.64 139.45,29.57 139.45,28.42 Q40.2 | 139.48,31.51 141.05,33.07 141.05,55.32 139.14,57.23 137.69,57.23 137.39,56.92 137.39,55.02 137.47,54.94 137.47,53.8 Q35.1
N$27
  Top 0.152: Q36.2 139.45,48.69 139.45,49.91 140.44,50.9 140.44,54.71 139.22,55.93 138.46,55.93 Q35.3
N$28
  Top 0.152: Q36.3 138.38,50.83 138.23,50.67 138.23,49.91 137.54,49.23 137.54,48.69 Q36.1 137.54,48.62 137.54,47.85 138.3,47.09 139.14,47.09 140.44,45.8 140.44,37.57 139.75,36.88 136.63,36.88 135.37,35.62 | 135.37,35.62 133.73,37.26 131.44,37.26 130.07,38.63 128.85,38.63 128.32,39.17 R10.1 128.25,39.24 127.56,39.24 126.87,39.93 123.37,39.93 OP5.6 | 135.37,35.62 135.41,35.59 135.41,31.62 137.47,29.57 137.47,28.42 Q40.1
N$29  (via drill 0.35)
  Top 0.152: v103.78,56.01 103.78,55.32 102.79,54.33 102.34,54.33 Q5.2 | v106.98,63.17 107.14,63.32 107.14,64.16 107.37,64.39 Q13.2 107.44,64.39 107.82,64.39 108.74,63.48 114.22,63.48 116.05,65.3 117.88,65.3 OP2.1
  Bottom 0.152: v103.78,56.01 103.78,59.97 v106.98,63.17
N$30
  Top 0.152: Q13.3 106.38,66.6 106.38,65.68 105.54,64.85 105.54,64.47 Q13.1 105.46,64.39 105.46,62.56 104.39,61.49 104.39,58.37 104.81,57.95 | 104.81,57.95 104.93,58.06 106.15,58.06 107.37,59.28 Q14.2 | 104.81,57.95 102.11,55.24 101.73,55.24 101.5,55.02 101.5,54.94 100.89,54.33 100.43,54.33 Q5.1
N$31
  Top 0.152: Q6.2 102.34,49.23 102.34,50.37 102.41,50.44 102.41,52.35 101.73,53.03 100.05,53.03 99.59,53.49 99.59,55.02 101.04,56.46 Q5.3
N$32
  Top 0.152: Q6.3 101.35,51.36 101.27,51.28 101.27,50.44 100.43,49.61 100.43,49.23 Q6.1 100.43,49.15 100.43,48.39 100.89,47.93 102.56,47.93 104.39,49.76 104.39,56.46 105.69,57.76 107.75,57.76 108.43,58.45 108.43,60.27 107.78,60.92 | 107.78,60.92 108.36,61.49 112.47,61.49 113,62.03 R3.1 113.08,62.1 113.77,62.1 115.75,64.08 117.88,64.08 OP2.2 | 107.78,60.92 107.21,60.35 106.83,60.35 106.53,60.05 106.53,59.97 105.92,59.36 105.54,59.36 Q14.1
N$33  (via drill 0.35)
  Top 0.152: 108.39,52.46 107.52,53.34 107.52,54.18 107.44,54.25 Q15.2 | 108.39,52.46 108.43,52.43 108.43,48.23 108.13,47.93 107.44,47.93 107.14,47.62 105.69,47.62 104.09,46.02 104.09,45.49 102.72,44.12 102.34,44.12 Q7.2 | v122,64.08 123.29,64.08 OP2.7 | 108.39,52.46 v108.51,52.58
  Bottom 0.152: v122,64.08 120.02,64.08 v108.51,52.58
N$34
  Top 0.152: Q15.3 106.38,56.46 106.3,56.39 106.3,55.47 105.54,54.71 105.54,54.33 Q15.1 105.54,54.25 105.54,53.42 106.3,52.65 107.14,52.65 107.52,52.27 107.52,49.3 107.44,49.23 Q16.2 107.37,49.15 107.21,49 107.21,48.23 106.91,47.93 104.93,47.93 102.11,45.11 101.73,45.11 101.5,44.88 101.5,44.81 100.81,44.12 100.43,44.12 Q7.1
N$35  (via drill 0.35)
  Top 0.152: v102.41,42.82 102.41,40.31 102.34,40.23 102.34,39.09 Q8.2 | v102.41,46.33 101.35,46.33 Q7.3
  Bottom 0.152: v102.41,46.33 v102.41,42.82
N$36  (via drill 0.35)
  Top 0.152: v122,62.79 123.29,62.79 OP2.6 | v126.8,62.79 127.48,62.1 128.25,62.1 R4.1 | 101.19,41 101.19,41.07 Q8.3 101.19,41 | 101.19,41 101.19,40.23 100.43,39.47 100.43,39.09 Q8.1 | 105.39,49.23 104.32,49.23 102.64,47.55 100.58,47.55 99.59,46.56 99.59,42.6 101.19,41 | 105.39,49.23 105.46,49.23 Q16.1 105.39,49.23 | 105.39,49.23 v105.39,50.44
  Bottom 0.152: v126.8,62.79 v122,62.79 119.63,62.79 107.29,50.44 v105.39,50.44
N$37  (via drill 0.35)
  Top 0.152: 130.76,36.96 128.02,36.96 v125.65,39.32 | 130.76,36.96 133.58,36.96 134.42,36.12 134.42,34.75 134.34,34.67 134.34,33.45 Q29.2 | v121.39,43.59 121.39,46.71 119.86,48.23 119.86,49.15 118.95,50.06 OP4.1 | v134.34,72.24 134.34,74.07 Q21.2 | 130.76,36.96 v130.76,37.03
  Bottom 0.152: v121.39,43.59 v125.65,39.32 | v134.34,72.24 134.34,66.37 137.62,63.09 137.62,42.14 135.71,40.23 131.22,40.23 130.76,39.78 v130.76,37.03
N$38  (via drill 0.35)
  Top 0.152: 134.38,31.51 133.73,32.16 132.89,32.16 132.59,32.46 132.59,33.22 132.44,33.38 Q29.1 132.44,33.45 132.59,33.6 132.59,34.44 133.35,35.2 Q29.3 | 134.38,31.51 134.42,31.47 134.42,29.64 134.34,29.57 134.34,28.42 Q30.2 | v133.66,72.85 132.82,72.85 132.44,73.23 132.44,74.07 Q21.1 | 134.38,31.51 v134.49,31.62
  Bottom 0.152: v133.66,72.85 134.65,72.85 140.13,67.36 140.13,34.67 137.08,31.62 v134.49,31.62
N$39
  Top 0.152: Q22.2 134.34,69.04 134.34,70.18 135.41,71.25 135.41,74.98 134.11,76.28 Q21.3
N$40  (via drill 0.35)
  Top 0.152: Q22.3 133.35,71.17 133.27,71.09 133.27,70.26 132.44,69.42 132.44,69.04 Q22.1 132.44,68.96 132.44,67.67 129.84,65.08 129.84,61.19 127.41,58.75 127.1,58.75 125.58,57.23 v125.58,48.77 | 119.29,48.35 118.95,48.69 118.03,48.69 117.96,48.77 OP4.2 | 119.29,48.35 120.78,46.86 120.78,39.32 131.67,28.42 132.36,28.42 Q30.1 | v115.75,46.86 113.08,46.86 R7.1 | v119.25,48.31 119.29,48.35
  Bottom 0.152: v115.75,46.86 117.81,46.86 v119.25,48.31 119.71,48.77 v125.58,48.77
N$41  (via drill 0.35)
  Top 0.152: 135.29,64.5 137.39,66.6 137.39,67.06 137.77,67.44 139.83,67.44 140.44,68.05 140.44,72.24 139.52,73.15 139.52,73.99 139.45,74.07 Q31.2 | 135.29,64.5 134.72,63.93 134.34,63.93 Q23.2 | v118.87,51.97 122,48.84 123.29,48.84 OP4.7 | v135.33,64.47 135.29,64.5
  Bottom 0.152: v118.87,51.97 117.35,51.97 115.14,54.18 115.14,54.79 122.53,62.18 133.04,62.18 v135.33,64.47
N$42
  Top 0.152: Q31.3 138.38,76.28 138.3,76.2 138.3,75.29 137.54,74.52 137.54,74.14 Q31.1 137.54,74.07 137.54,73.23 138.3,72.47 139.14,72.47 139.52,72.08 139.52,69.11 139.45,69.04 Q32.2 139.37,68.96 139.22,68.81 139.22,68.05 138.91,67.74 136.93,67.74 134.11,64.92 133.73,64.92 133.5,64.69 133.5,64.62 132.82,63.93 132.44,63.93 Q23.1
N$43
  Top 0.152: Q24.2 134.34,58.9 134.34,60.05 134.42,60.12 134.42,61.95 133.73,62.64 132.13,62.64 131.6,63.17 131.6,64.77 132.89,66.06 133.35,66.06 Q23.3
N$44  (via drill 0.35)
  Top 0.152: v122,47.55 123.29,47.55 OP4.6 | R8.1 128.25,46.86 127.48,46.86 v126.8,47.55 126.8,48.54 126.19,49.15 126.19,55.09 126.95,55.85 129.46,55.85 131.37,57.76 131.37,57.91 132.36,58.9 Q24.1 132.44,58.9 132.44,59.28 133.2,60.05 133.2,60.81 | 133.2,60.81 133.2,60.88 Q24.3 133.2,60.81 | 133.2,60.81 131.29,62.71 131.29,66.06 132.59,67.36 134.65,67.36 136.32,69.04 137.47,69.04 Q32.1
  Bottom 0.152: v126.8,47.55 v122,47.55
N$45
  Top 0.152: LED1.A 90.98,25.68 91.52,25.68 96.24,30.4 96.24,32.61 95.86,32.99 93.04,32.99 91.67,31.62 90.98,31.62 R12.2
N$46
  Top 0.152: LED2.A 77.5,25.45 78.11,25.45 78.41,25.76 78.41,27.58 74.98,31.01 74.98,31.32 R13.2
N$47
  Top 0.152: R15.2 94.72,31.55 93.34,31.55 86.94,25.15 78.33,25.15 77.95,24.77 65.38,24.77 63.55,26.59 63.55,27.13 JP2.1
N$48
  Top 0.152: R14.2 78.72,31.62 77.11,31.62 76.05,32.69 73.23,32.69 72.24,31.7 70.26,31.7 67.97,29.41 57.61,29.41 55.93,27.74 55.93,27.2 JP1.1
R+
  Top 0.381: C3.1 87.63,33.22 89.46,33.22 89.69,32.99 89.76,33.07 92.2,33.07 93.04,33.91 93.04,39.78 95.4,42.14 C1.+ 95.4,42.29 95.4,50.52 96.16,51.28 96.16,54.79 90.07,60.88 89.23,60.88 D1.C 88.16,60.96 86.41,62.71 | 86.41,62.71 75.06,62.71 70.48,67.28 64.01,67.28 B1.+ | VREG2.1 89.08,67.21 89.08,65.46 86.49,62.87 86.41,62.71
R-  (via drill 0.35)
  Top 0.381: v86.56,31.01 86.72,30.86 87.63,30.86 C4.2 | v74.3,41.07 73.23,42.14 71.7,42.14 C2.- | 71.25,69.88 64.01,69.88 B1.- | 71.25,69.88 74.98,73.61 75.67,73.61 VREG1.2 | v75.29,60.96 D2.A | v71.4,69.65 71.32,69.72 71.25,69.88
  Bottom 0.381: v86.56,31.01 76.5,41.07 75.36,41.07 | v74.3,41.07 75.36,41.07 | v71.4,69.65 71.4,64.62 75.06,60.96 v75.29,60.96 75.36,60.81 75.36,41.07
T_OUT0  (via drill 0.35)
  Top 0.152: v99.9,31.55 100.36,31.09 101.35,31.09 Q10.3
  Bottom 0.152: v99.9,31.55 88.01,31.55 75.44,18.97 50.6,18.97 48.69,17.07 48.01,17.07 J1.6
T_OUT1  (via drill 0.35)
  Top 0.152: v109.04,70.41 107.75,71.7 106.45,71.7 Q12.3
  Bottom 0.152: v109.04,70.41 109.04,66.14 94.79,51.89 94.79,46.33 103.02,38.1 103.02,33.76 88.24,18.97 76.66,18.97 74.98,17.3 74.98,15.47 74.52,15.01 60.58,15.01 58.6,16.99 58.06,16.99 J1.8
T_OUT2  (via drill 0.35)
  Top 0.152: Q26.3 133.35,49.76 133.2,49.61 133.2,47.78 133.88,47.09 134.04,47.09 135.41,45.72 135.41,38.33 v135.33,38.25 | v114.68,24 75.59,24 68.66,17.07 68.05,17.07 J1.10
  Bottom 0.152: v135.33,38.25 132.89,38.25 118.64,24 v114.68,24
T_OUT3  (via drill 0.35)
  Top 0.152: v132.13,40.84 132.21,40.77 133.35,40.77 Q28.3 | v113.16,23.39 84.96,23.39 78.64,17.07 78.03,17.07 J1.12
  Bottom 0.152: v132.13,40.84 130.61,40.84 v113.16,23.39
T_OUT4  (via drill 0.35)
  Top 0.152: v137.39,40.69 137.47,40.77 138.38,40.77 Q38.3 | v139.52,36.27 139.37,36.27 139.06,36.58 137.77,36.58 136.02,34.82 v136.02,34.06
  Bottom 0.152: v137.39,40.69 137.39,38.41 v139.52,36.27 | v136.02,34.06 119.86,17.91 119.86,15.54 119.33,15.01 90.6,15.01 88.62,16.99 J1.14
T_OUT5
  Top 0.152: Q40.3 138.46,30.56 138.46,29.41 138.53,29.34 138.53,27.43 129.84,18.75 129.84,15.54 129.31,15.01 100.58,15.01 98.6,16.99 98.07,16.99 J1.16
T_OUT6  (via drill 0.35)
  Top 0.152: v105.39,60.66 105.39,60.88 105.99,61.49 106.38,61.49 Q14.3 | v98.68,50.44 98.68,26.9 v100.51,25.07
  Bottom 0.152: v105.39,60.66 105.39,56.69 99.14,50.44 v98.68,50.44 | v100.51,25.07 107.97,17.6 107.97,17.07 J1.18
T_OUT7  (via drill 0.35)
  Top 0.152: v104.17,48.08 104.62,48.08 104.78,48.23 106.07,48.23 106.3,48.46 106.3,50.14 106.38,50.22 106.38,51.36 Q16.3
  Bottom 0.152: v104.17,48.08 104.17,31.47 117.96,17.68 117.96,17.07 J1.20
T_OUT8
  Top 0.152: Q30.3 133.35,29.41 133.2,29.26 133.2,27.51 133.35,27.36 133.35,22.94 128.02,17.6 128.02,17.07 J1.22
T_OUT9  (via drill 0.35)
  Top 0.152: v137.39,71.02 137.54,71.17 138.38,71.17 Q32.3
  Bottom 0.152: v137.39,71.02 137.39,70.56 140.44,67.51 140.44,20.04 138.07,17.68 138.07,17.07 J1.24
TEMP_PROBE-
  Top 0.152: OP2.3 117.96,62.79 118.11,62.79 118.95,63.63 118.95,65.76 116.66,68.05 116.66,70.1 116.97,70.41 117.88,70.41 OP1.3 117.96,70.41 118.95,70.41 120.24,69.11 121.39,69.11 | 121.39,69.11 123.29,69.11 OP1.5 | OP5.5 123.29,38.63 122.3,38.63 122,38.94 122,44.73 123.29,46.02 123.29,46.18 OP4.5 123.22,46.18 122.38,46.18 120.17,48.39 120.17,49.76 118.3,51.63 | 119.25,55.17 121.01,55.17 121.04,55.13 | 119.25,55.17 117.96,55.17 OP3.3 | 121.04,55.13 122.3,53.87 123.29,53.87 OP3.5 | 121.04,55.13 121.08,55.17 121.08,57.3 123.37,59.59 123.37,61.42 OP2.5 123.29,61.49 122.3,61.49 121.39,62.41 121.39,69.11 | 118.3,51.63 118.26,51.66 118.26,52.27 119.25,53.26 119.25,55.17 | 116.97,41.6 116.97,42.9 119.25,45.19 119.25,47.24 118.95,47.55 117.96,47.55 OP4.3 117.88,47.47 117.12,48.23 117.04,48.23 116.97,48.31 116.97,50.52 118.03,51.59 118.26,51.59 118.3,51.63 | 116.97,41.6 116.97,40.69 117.73,39.93 117.88,39.93 OP5.3 | 116.97,41.6 117.12,41.76 118.8,41.76 118.95,41.6 119.02,41.6 119.56,41.07 119.56,40.08 122.07,37.57 122.07,33.07 R11.1 122,32.99 121.84,32.99 113.31,24.46 46.94,24.46 39.55,17.07 38.02,17.07 J1.4
V+  (via drill 0.35)
  Top 0.381: 124.62,49.72 124.21,50.14 124.13,50.06 123.37,50.06 OP4.8 | 124.62,49.72 124.82,49.53 124.82,45.72 123.37,44.27 123.37,42.44 OP5.8 | 124.62,57.57 124.82,57.38 124.82,49.91 124.62,49.72 | 124.62,57.57 124.51,57.68 123.37,57.68 OP3.8 | 124.62,65.19 124.82,65 124.82,57.76 124.62,57.57 | 124.62,65.19 124.51,65.3 123.37,65.3 OP2.8 | 124.62,65.19 124.82,65.38 124.82,72.62 124.51,72.92 123.37,72.92 OP1.8 123.22,72.92 122.15,72.92 120.93,74.14 111.78,74.14 110.87,73.23 100.74,73.23 94.79,67.28 93.88,67.28 VREG2.3 93.73,67.21 93.73,60.96 D1.A 93.57,60.88 v91.97,60.88 | 75.06,35.81 76.5,35.81 77.42,34.9 78.26,34.9 78.72,34.44 R14.1 78.87,34.52 79.25,34.9 80.09,34.9 81.46,36.27 88.39,36.27 88.92,35.74 88.92,35.59 90.07,34.44 90.91,34.44 R12.1 | 75.06,35.81 73.76,35.81 73.23,35.28 73.23,33.83 72.39,32.99 71.63,32.99 C5.1 71.55,32.77 70.71,32.77 69.19,31.24 48.77,31.24 34.59,17.07 33.07,17.07 J1.3 | 75.06,35.81 75.06,42.98 73.38,44.65 73.38,53.03 D3.C 73.53,53.11 74.3,53.11 v76.12,54.94
  Bottom 0.381: v91.97,60.88 82.07,60.88 v76.12,54.94
V-  (via drill 0.35)
  Top 0.381: 117.08,45.07 117.65,45.64 117.65,46.1 117.73,46.18 117.88,46.18 OP4.4 | 117.08,45.07 116.51,44.5 116.51,38.86 116.74,38.63 117.88,38.63 OP5.4 | 116.51,50.22 116.51,45.64 117.08,45.07 | 116.51,50.22 116.51,51.13 117.96,52.58 117.96,53.8 OP3.4 117.81,53.87 117.2,53.87 117.12,53.8 116.51,54.41 116.51,58.29 117.96,59.74 117.96,61.42 OP2.4 118.11,61.49 118.72,61.49 118.8,61.42 119.41,62.03 119.41,65.91 117.96,67.36 117.96,69.04 OP1.4 | LED2.C 77.42,26.9 76.05,26.9 72.54,30.4 71.78,30.4 71.63,30.56 C6.2 71.55,30.4 70.71,30.4 67.51,27.2 66.06,27.2 JP2.2 | v77.95,65.46 77.95,67.21 VREG1.3 | v75.13,61.95 74.14,60.96 D2.C 74.3,60.88 75.97,59.21 | 75.97,59.21 86.41,59.21 92.51,53.11 93.73,53.11 D4.A 93.95,53.03 v95.4,51.59 | v74.6,57.76 75.89,59.05 75.97,59.21 | v116.36,50.22 116.51,50.22
  Bottom 0.381: v77.95,65.46 77.95,64.77 v75.13,61.95 | v74.6,57.76 73.53,56.69 73.53,35.81 66.06,28.35 66.06,27.2 JP2.2 | v116.36,50.22 107.67,50.22 107.14,49.68 97.31,49.68 v95.4,51.59

### Text on the board
tPlace: REV-003 | 500mA 250VAC 5X20MM | Alex Hansen / (727) 465-4797 / ajhansen1991@outlook.com | -12V | +12V | AC+ | AC- | GND | GND | GND | GND | GND | GND | GND | GND | GND | GND | GND | 12VDC | TP_IN | TOUT0 | TOUT1 | TOUT2 | TOUT3 | TOUT4 | TOUT5 | TOUT6 | TOUT7 | TOUT8 | TOUT9